# Altium schematic sheet 03_NOTECARD-CONNECTION.SchDoc
size A4; CheckedBy: Inženjer 2; CompanyName: Byte Lab Grupa d.o.o.; Engineer: Matija Puskar; Organization: Byte Lab Grupa d.o.o.; Address1: Medarska 69/1, 10000 Zagreb, Croatia; DocumentNumber: 1; SheetNumber: 3; SheetTotal: 7; Web: www.byte-lab.com; ProjectName: P1X-0XX
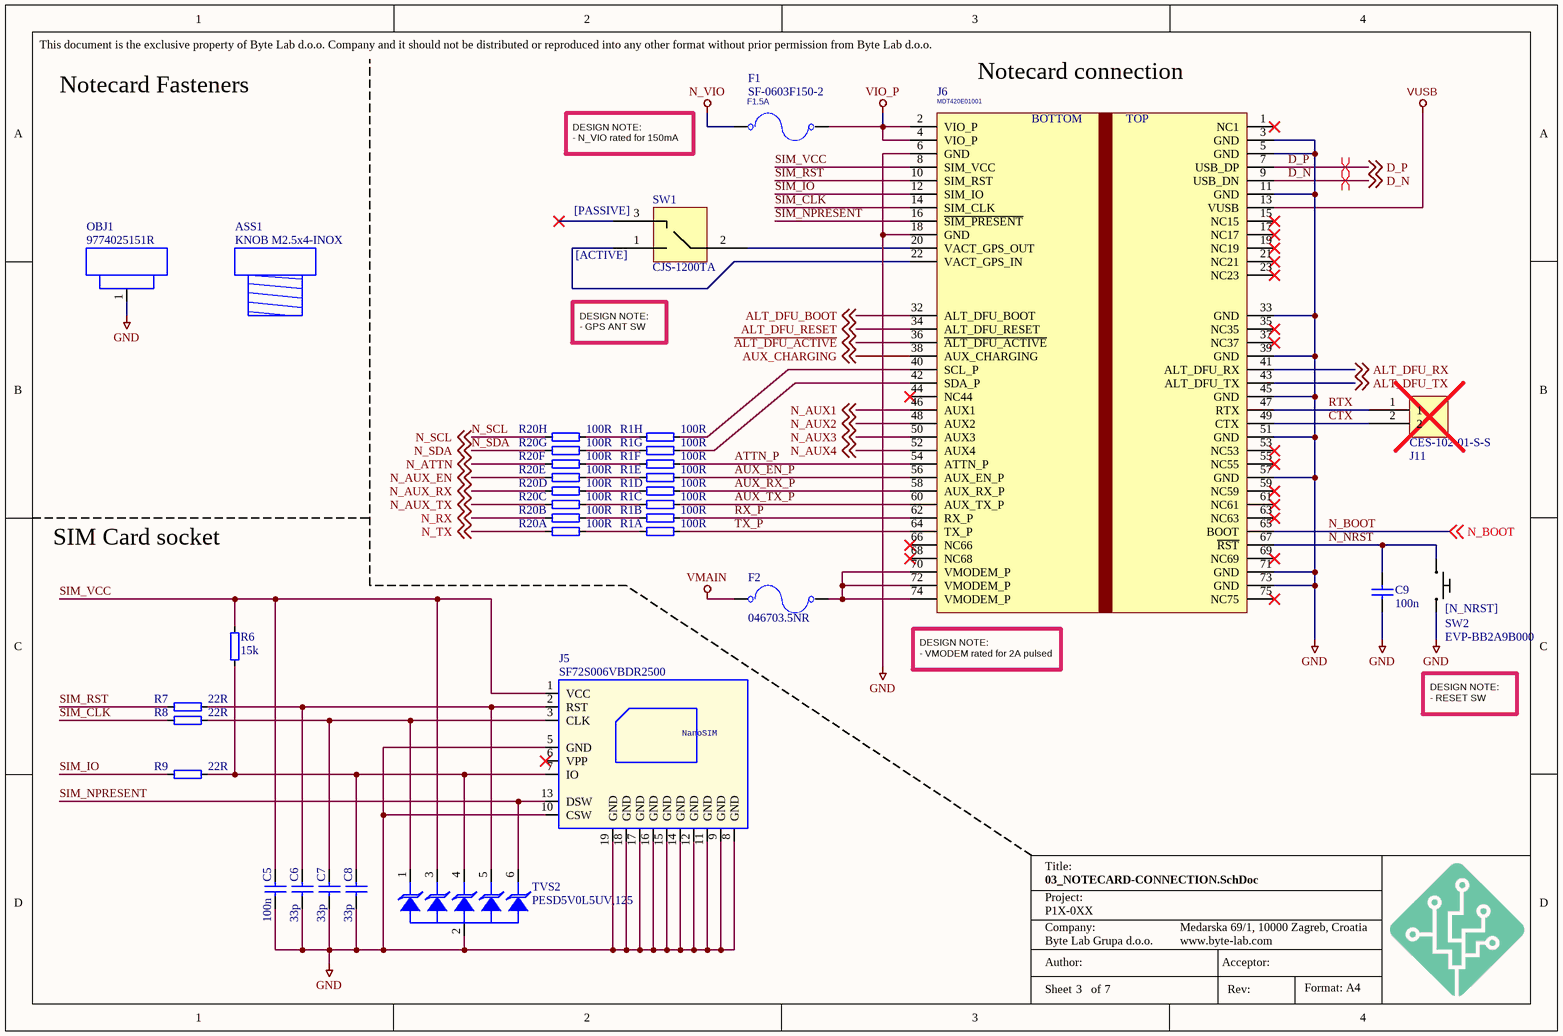
[diagram p0: 03_NOTECARD-CONNECTION.SchDoc]

## Parts
ASS1  KNOB M2.5x4-INOX  (mechanical)
C5  100n  [C-0402]
C6  33p  [C-0402]
C7  33p  [C-0402]
C8  33p  [C-0402]
C9  100n  [C-0402]
F1  SF-0603F150-2  [FS-0603]
F2  046703.5NR  [FS-0603]
J5  SF72S006VBDR2500  [J-NANOSIM-SF72S006VBA]
J6  MDT420E01001  [J-75-0050-MOS-M2]
J11  CES-102-01-S-S  [CONN_02]  (no BOM)
OBJ1  9774025151R  [DIST-WASMSIM0250]
R1  100R  [RESCAXS80P640X160X50-16N]  (parts A,B,C,D,E,F,G,H of 8)
R6  15k  [R-0402]
R7  22R  [R-0402]
R8  22R  [R-0402]
R9  22R  [R-0402]
R20  100R  [RESCAXS80P640X160X50-16N]  (parts A,B,C,D,E,F,G,H of 8)
SW1  CJS-1200TA  [SW_CJS-1200TA]
SW2  EVP-BB2A9B000  [SW_EVP-BB2A9B000]
TVS2  PESD5V0L5UV,125  [SOT666]

## Nets
GND: C5.1 C6.1 C7.1 C8.1 C9.1 J5.5(GND) J5.8(GND) J5.9(GND) J5.10(CSW) J5.11(GND) J5.12(GND) J5.14(GND) J5.15(GND) J5.16(GND) J5.17(GND) J5.18(GND) J5.19(GND) J6.3(GND) J6.5(GND) J6.6(GND) J6.11(GND) J6.18(GND) J6.33(GND) J6.39(GND) J6.45(GND) J6.51(GND) J6.57(GND) J6.71(GND) J6.73(GND) OBJ1.1 SW2.2(B) TVS2.2(A2)
N_VIO: F1.1
VIO_P: F1.2 J6.2(VIO_P) J6.4(VIO_P)
VMAIN: F2.1
VUSB: J6.13(VUSB)
~{ALT_DFU_ACTIVE}: J6.36(~{ALT_DFU_ACTIVE}) ; off-sheet ~{ALT_DFU_ACTIVE}
ALT_DFU_BOOT: J6.32(ALT_DFU_BOOT) ; off-sheet ALT_DFU_BOOT
ALT_DFU_RESET: J6.34(ALT_DFU_RESET) ; off-sheet ALT_DFU_RESET
ALT_DFU_RX: J6.41(ALT_DFU_RX) ; off-sheet ALT_DFU_RX
ALT_DFU_TX: J6.43(ALT_DFU_TX) ; off-sheet ALT_DFU_TX
ATTN_P: J6.54(ATTN_P) R1.11
AUX_CHARGING: J6.38(AUX_CHARGING) ; off-sheet AUX_CHARGING
AUX_EN_P: J6.56(AUX_EN_P) R1.12
AUX_RX_P: J6.58(AUX_RX_P) R1.13
AUX_TX_P: J6.60(AUX_TX_P) R1.14
CTX: J6.49(CTX) J11.2
D_N: J6.9(USB_DN) ; off-sheet D_N
D_P: J6.7(USB_DP) ; off-sheet D_P
N_ATTN: R20.6 ; off-sheet N_ATTN
N_AUX1: J6.46(AUX1) ; off-sheet N_AUX1
N_AUX2: J6.48(AUX2) ; off-sheet N_AUX2
N_AUX3: J6.50(AUX3) ; off-sheet N_AUX3
N_AUX4: J6.52(AUX4) ; off-sheet N_AUX4
N_AUX_EN: R20.5 ; off-sheet N_AUX_EN
N_AUX_RX: R20.4 ; off-sheet N_AUX_RX
N_AUX_TX: R20.3 ; off-sheet N_AUX_TX
N_BOOT: J6.65(BOOT) ; off-sheet N_BOOT
N_NRST: C9.2 J6.67(~{RST}) SW2.1(A)
N_RX: R20.2 ; off-sheet N_RX
N_SCL: R20.8 ; off-sheet N_SCL
N_SDA: R20.7 ; off-sheet N_SDA
N_TX: R20.1 ; off-sheet N_TX
RTX: J6.47(RTX) J11.1
RX_P: J6.62(RX_P) R1.15
SIM_CLK: J6.14(SIM_CLK) R8.1
SIM_IO: J6.12(SIM_IO) R9.1
SIM_NPRESENT: J5.13(DSW) J6.16(~{SIM_PRESENT}) TVS2.6(C6)
SIM_RST: J6.10(SIM_RST) R7.1
SIM_VCC: C5.2 J5.1(VCC) J6.8(SIM_VCC) R6.2 TVS2.3(C3)
TX_P: J6.64(TX_P) R1.16
NetC6_2: C6.2 J5.2(RST) R7.2 TVS2.5(A5)
NetC7_2: C7.2 J5.3(CLK) R8.2 TVS2.1(C1)
NetC8_2: C8.2 J5.7(IO) R6.1 R9.2 TVS2.4(C4)
NetF2_2: F2.2 J6.70(VMODEM_P) J6.72(VMODEM_P) J6.74(VMODEM_P)
NetJ6_20: J6.20(VACT_GPS_OUT) SW1.2
NetJ6_22: J6.22(VACT_GPS_IN) SW1.1
NetJ6_40: J6.40(SCL_P) R1.9
NetJ6_42: J6.42(SDA_P) R1.10
NetR1_1: R1.1 R20.16
NetR1_2: R1.2 R20.15
NetR1_3: R1.3 R20.14
NetR1_4: R1.4 R20.13
NetR1_5: R1.5 R20.12
NetR1_6: R1.6 R20.11
NetR1_7: R1.7 R20.10
NetR1_8: R1.8 R20.9

Not connected (* = marked no-connect by the designer): J5 6(VPP)*; J6 1(NC1)* 15(NC15)* 17(NC17)* 19(NC19)* 21(NC21)* 23(NC23)* 35(NC35)* 37(NC37)* 44(NC44)* 53(NC53)* 55(NC55)* 59(NC59)* 61(NC61)* 63(NC63)* 66(NC66)* 68(NC68)* 69(NC69)* 75(NC75)*; SW1 3*

## Layout directives
differential pair: D_N, D_P

## Notes on the sheet
- Notecard Fasteners
- (near J6) Notecard connection
- DESIGN NOTE:
  - N_VIO rated for 150mA
- (near SW1) [PASSIVE]
- (near SW1) [ACTIVE]
- DESIGN NOTE:
  - GPS ANT SW
- SIM Card socket
- (near SW2) [N_NRST]
- (near J6) DESIGN NOTE:
  - VMODEM rated for 2A pulsed
- DESIGN NOTE:
  - RESET SW
- This document is the exclusive property of Byte Lab d.o.o. Company and it should not be distributed or reproduced into any other format without prior permission from Byte Lab d.o.o.
- Project:
- Title:
- Author:
- Company:
- Acceptor:
- Format: A4
- Sheet
- of
- Rev:
- (in symbol AMPHENOL-75 - M-2 KEY E_13) BOTTOM; TOP
- (in symbol NANOSIM - J-NANOSIM-SF72S006VBA) NanoSIM
- (in symbol RAPIDO - SF-0603F150-2-1.5A/32V) F1.5A

## Library data of the parts
ASS1 = KNOB - M2.5x4-INOX: VITE TCEI 2.5X4 ESAGONO INCASSATO A2 INOX; Manufacturer Part Number: M2.5X4/D7985-A2; Manufacturer: KRAFTBERG; BL Part Number: 6000-168; Drawn_By: Blues Wireless; Supplier Part Number 1: M2.5X4/D7985-A2; Supplier 1: TME
C5 C9 = C0402-100n-16V-X7R: Capacitor ceramic 100n ±10% X7R 16V 0402; BL Part Number: 2000-908; Drawn_By: Puskar; Checked_By: Dodig; Manufacturer: N/A; Supplier 1: Digi-Key; Supplier Part Number 1: 490-3261-1-ND; Note: *; Manufacturer Part Number: N/A; DateModified: 27-08-2013
C6-C8 = C0402-33p-50V-C0G-5: Capacitor ceramic 33p ±5% C0G 50V 0402; BL Part Number: 2001-377; Drawn_By: Puskar; Checked_By: Dodig; Manufacturer: N/A; Supplier 1: Digi-Key; Supplier Part Number 1: 1276-1272-1-ND; Note: *; Manufacturer Part Number: N/A; DateModified: 24-11-2013
F1 = RAPIDO - SF-0603F150-2-1.5A/32V: FUSIBILE RAPIDO 1.5A 32V 0603 SF-0603F150-2 BOURNS SMT; Manufacturer: Bourns Inc.; BL Part Number: 2007-468; Drawn_By: Blues Wireless; Manufacturer Part Number: SF-0603F150-2; Supplier Part Number 1: SF-0603F150-2CT-ND; Supplier 1: Digi-Key
F2 = 046703.5NR: Fuse Chip Very Fast Acting 3.5A 32V SMD Solder Pad 0603 T/R CSA; Manufacturer: Littelfuse Inc.; BL Part Number: 2007-469; Drawn_By: Blues Wireless; Supplier 1: Digi-Key; Supplier Part Number 1: F1400CT-ND; Manufacturer Part Number: 046703.5NR
J5 = NANOSIM - J-NANOSIM-SF72S006VBA: CONN. NANOSIM 8P F/90° PUSH-PUSH SF72S006VBAR2500 JAE ELECTRONICS SMT; BL Part Number: 2007-458; Drawn_By: Blues Wireless; Supplier 1: Digi-Key; Supplier Part Number 1: 670-2967-1-ND; Manufacturer Part Number: SF72S006VBDR2500; Manufacturer: JAE Electronics
J6 = AMPHENOL-75 - M-2 KEY E_13: CONN. M.2 75P M/90° P=0.5 MDT420E01001 AMPHENOL SMT; Manufacturer: Amphenol ICC (FCI); Manufacturer Part Number: MDT420E03001; BL Part Number: 2007-460; Drawn_By: Blues Wireless; Supplier 1: Digi-Key; Supplier Part Number 1: MDT420E03001CT-ND
J11 = CONN_02: 0,1" 2 PIN Header; Manufacturer: Samtec Inc.; BL Part Number: 2007-461; Drawn_By: Blues Wireless; Supplier 1: Digi-Key; Supplier Part Number 1: SAM1085-02-ND; Manufacturer Part Number: CES-102-01-S-S
OBJ1 = DISTANZIALE - M2.5x0250: DISTANZ. CIL. METALLO 5.1X2.5 9774025151R W.E SMT; Manufacturer: Würth Elektronik; BL Part Number: 6020-113; Drawn_By: Blues Wieless; Supplier 1: Digi-Key; Supplier Part Number 1: 732-7078-1-ND; Manufacturer Part Number: 9774025151R
R1 R20 = RESCAXS80P640X160X50-16N - 8x100R: Resistor array 100R 5% 2506; Manufacturer Part Number: 742C163101JP; Manufacturer: CTS Resistor Products; BL Part Number: 2007-472; Drawn_By: Hamin; DateModified: 08-05-2023; Checked_By: *; Note: *; Supplier 1: Digi-Key; Supplier Part Number 1: 742C163101JPCT-ND
R6 = R0402-15k-1: Resistor 15k ±1% 0402; BL Part Number: 2001-157; Checked_By: Zvonc; Drawn_By: Puskar; Supplier 1: Digi-Key; Manufacturer: N/A; Manufacturer Part Number: N/A; Supplier Part Number 1: P15.0KLCT-ND; DateModified: 23-01-2015; Note: *
R7-R9 = R0402-22R-1: Resistor 22R ±1% 0402; BL Part Number: 2001-170; Checked_By: Hamin; Drawn_By: Zvonc; Supplier 1: Digi-Key; Manufacturer: N/A; Manufacturer Part Number: N/A; Supplier Part Number 1: 311-22.0LRCT-ND; DateModified: 13-02-2021; Note: *
SW1 = CJS-1200TA: Switch Slide N.O./N.C. SPDT Raised Slide 0.1A 24VDC J-Hook SMD Embossed T/R; Manufacturer: Nidec Copal; BL Part Number: 2007-456; Drawn_By: Blues Wireless; Supplier 1: Digi-Key; Manufacturer Part Number: CJS-1200TA; Supplier Part Number 1: 563-1021-6-ND
SW2 = Switch tact EVP-BB2A9B000: SWITCH TACTILE SPST-NO 0.05A 15V; Manufacturer: Panasonic Electronic Components; BL Part Number: 2007-124; Drawn_By: Marsic; Manufacturer Part Number: EVP-BB2A9B000; Note: *; DateModified: 09-02-2023; Checked_By: *
TVS2 = PESD5V0L5UV,125: PESD Series 25 W 5 V Uni-Directional Fivefold ESD Protection Diode Array SOT-666; Manufacturer: Nexperia; BL Part Number: 2007-452; Drawn_By: Blues Wireless; Supplier 1: Digi-Key; Manufacturer Part Number: PESD5V0L5UV,125; Supplier Part Number 1: 1727-5797-1-ND